# EasyEDA Pro project MAX9814音频AGC放大.eprj

# Schematic Schematic1

## Sheets
1 P1: Board Name: Board1; Create Date: 2025-06-20; Page Name: P1; Project Name: MAX9814音频AGC放大; Schematic Name: Schematic1; Update Date: 2025-06-21; Page Size: A4; Version: V1.0
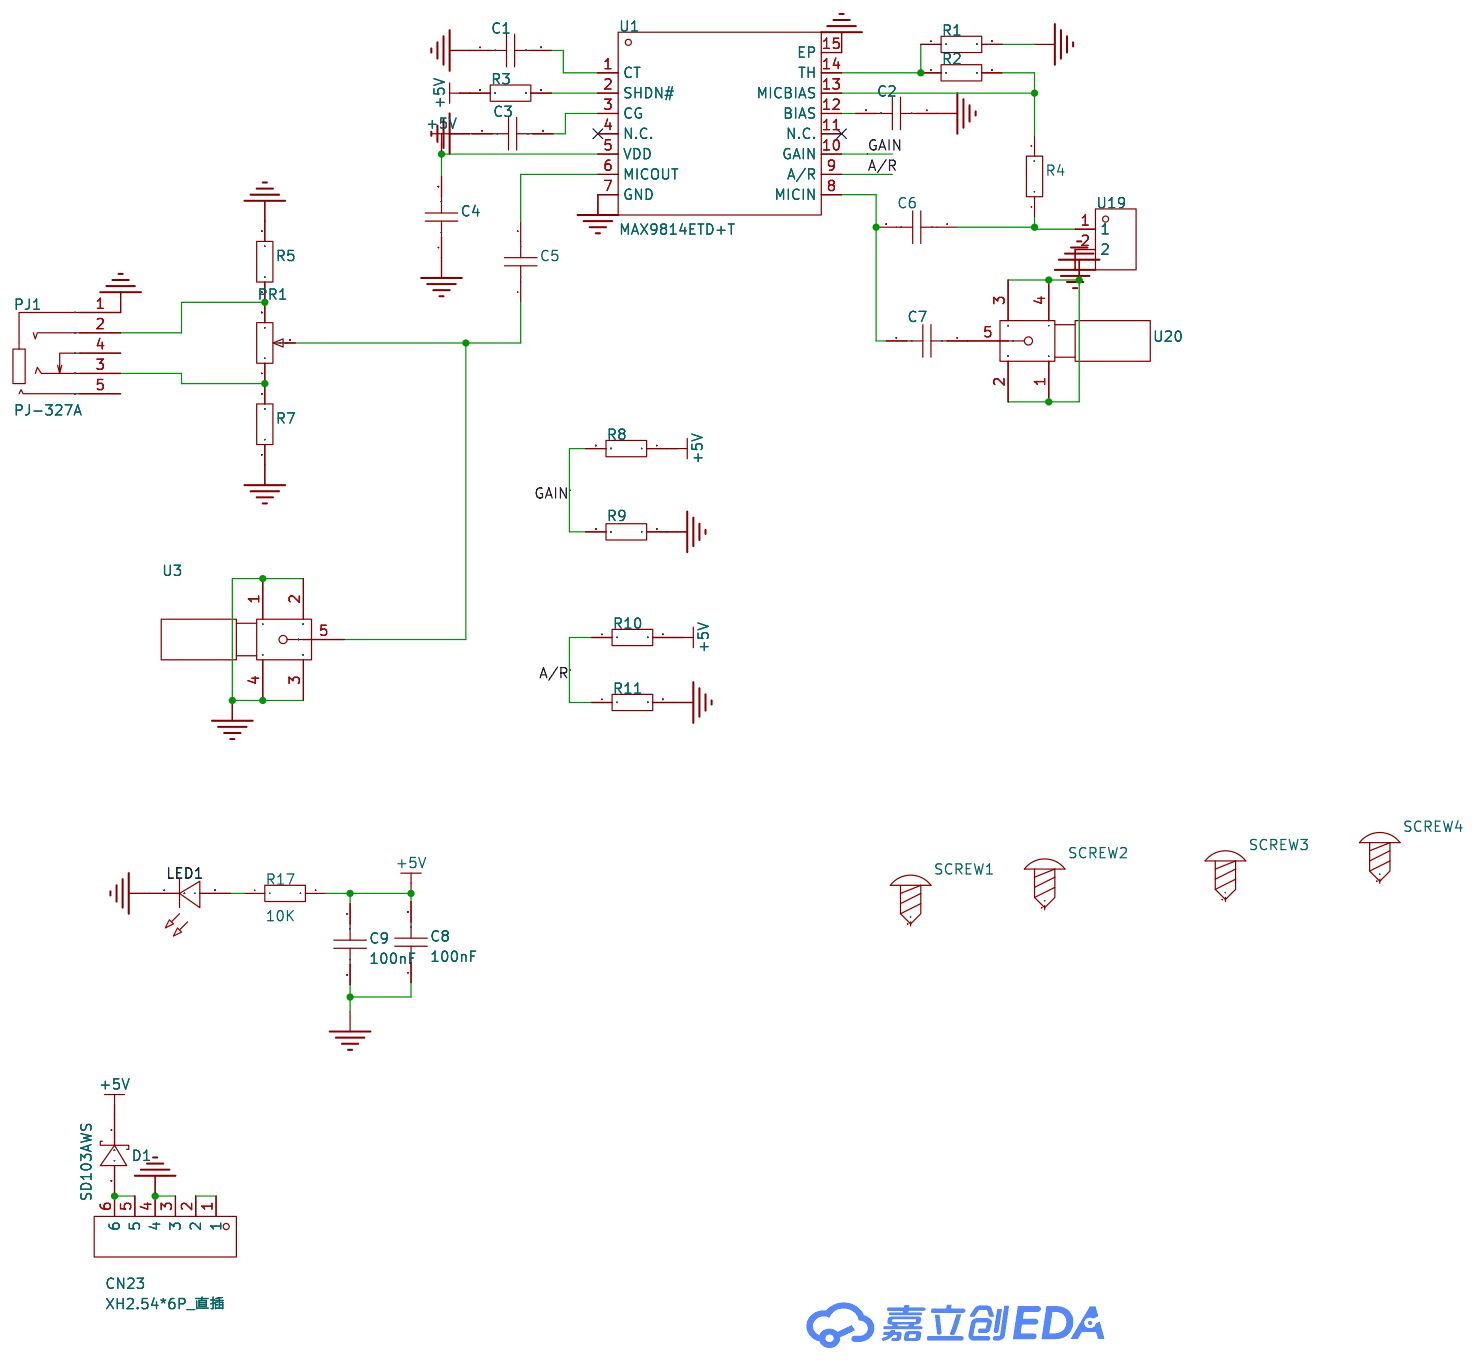
[diagram p0: P1]
2 P2: Create Date: 2025-06-24; Page Name: P2; Update Date: 2025-06-24
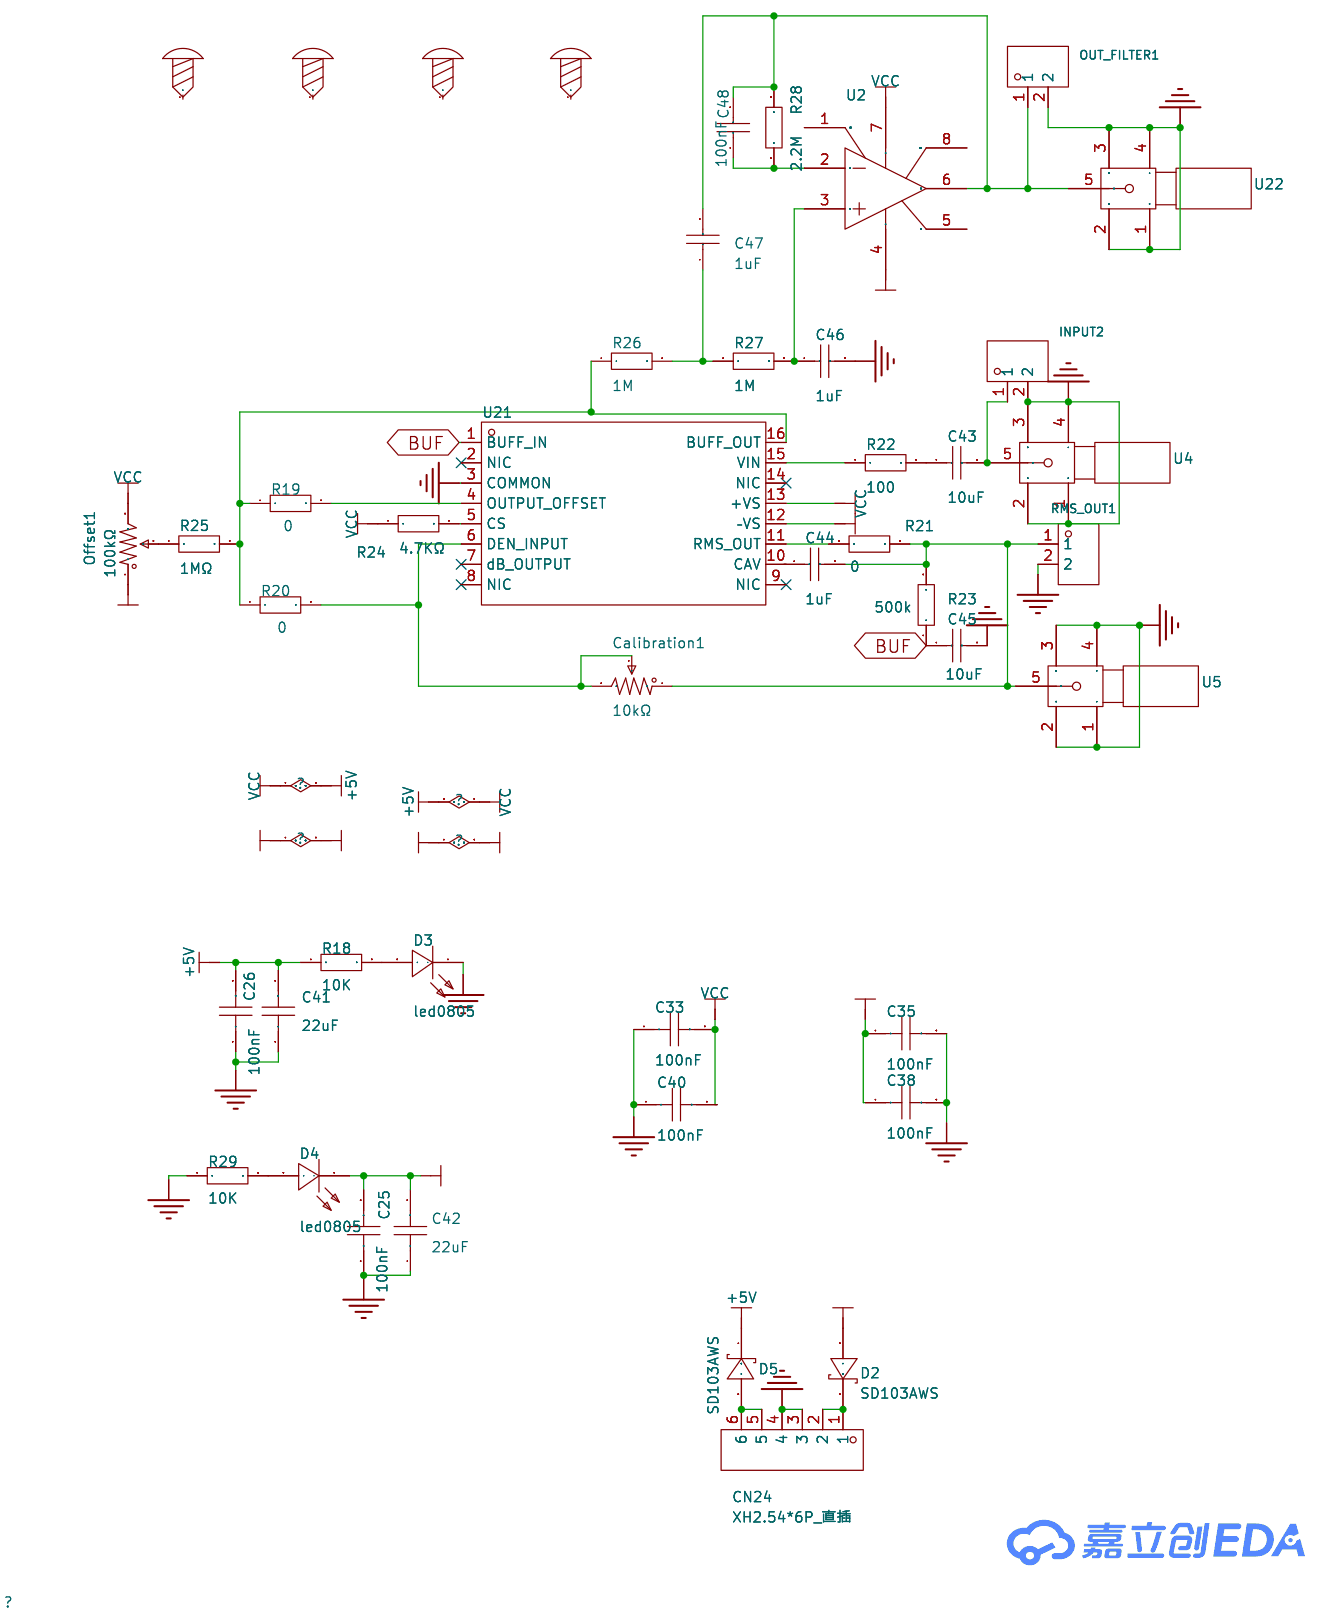
[diagram p1: P2]

## Parts
sheet P1
C1  100nF  [R0805]
C2  100nF  [R0805]
C3  100nF  [R0805]
C4  100nF  [R0805]
C5  100nF  [R0805]
C6  100nF  [R0805]
C7  100nF  [R0805]
C8  100nF  [C1206]
C9  100nF  [R0805]
CN23  XH2.54*6P_直插  [CONN-TH_XH2.54-6P]
D1  SD103AWS  [SOD-323_L1.8-W1.3-LS2.5-RD]
LED1  -  [LED_0805]
PJ1  PJ-327A  [AUDIO-IN-SMD_PJ-327A_C22355751]
PR1  10kΩ  [R_3296]
R1  10K  [R0805]
R2  10K  [R0805]
R3  10K  [R0805]
R4  10K  [R0805]
R5  10K  [R0805]
R7  10K  [R0805]
R8  10K  [R0805]
R9  10K  [R0805]
R10  10K  [R0805]
R11  10K  [R0805]
R17  10K  [R0805]
SCREW1  -  [M3螺丝]
SCREW2  -  [M3螺丝]
SCREW3  -  [M3螺丝]
SCREW4  -  [M3螺丝]
U1  MAX9814ETD+T  [TDFN-14_L3.0-W3.0-P0.40-BL-EP]
U3  -  [SMA]
U19  KF301-5.0-2P  [CONN-TH_P5.00_KF301-5.0-2P]
U20  -  [SMA]
sheet P2
C25  100nF  [R0805]
C26  100nF  [R0805]
C33  100nF  [R0805]
C35  100nF  [R0805]
C38  100nF  [R0805]
C40  100nF  [R0805]
C41  22uF  [C1210]
C42  22uF  [C1210]
C43  10uF  [R0805]
C44  1uF  [R0805]
C45  10uF  [R0805]
C46  1uF  [R0805]
C47  1uF  [R0805]
C48  100nF  [R0805]
Calibration1  10kΩ  [RES-ADJ-TH_3P-L10.0-W10.0-P2.50-L]
CN24  XH2.54*6P_直插  [CONN-TH_XH2.54-6P]
D2  SD103AWS  [SOD-323_L1.8-W1.3-LS2.5-RD]
D3  led0805  [LED0805-RD]
D4  led0805  [LED0805-RD]
D5  SD103AWS  [SOD-323_L1.8-W1.3-LS2.5-RD]
INPUT2  PZ254V-11-02P  [HDR-TH_2P-P2.54-V-M]
Offset1  100kΩ  [RES-ADJ-TH_3P-L10.0-W10.0-P2.50-L]
OUT_FILTER1  PZ254V-11-02P  [HDR-TH_2P-P2.54-V-M]
R18  10K  [R0805]
R19  0  [R0805]
R20  0  [R0805]
R21  0  [R0805]
R22  100  [R0805]
R23  500k  [R0603]
R24  4.7KΩ  [R0805]
R25  1MΩ  [R0805]
R26  1M  [R0805]
R27  1M  [R0805]
R28  2.2M  [R0805]
R29  10K  [R0805]
RMS_OUT1  PZ254V-11-02P  [HDR-TH_2P-P2.54-V-M]
SCREW5  -  [M3螺丝]
SCREW6  -  [M3螺丝]
SCREW7  -  [M3螺丝]
SCREW8  -  [M3螺丝]
U2  OP07  [SOP-8_L4.9-W3.9-P1.27-LS6.0-BL]
U4  -  [SMA]
U5  -  [SMA]
U21  AD637ARZ  [SOIC-16_L10.3-W7.5-P1.27-LS10.3-BL]
U22  -  [SMA]

## Library data of the parts
C1-C7 C9 = CAP_0603: Supplier Footprint: 0603
C8 = CAP_1206: Supplier Footprint: 1206
CN23 CN24 = XH2.54*6P_直插: Supplier Part: C9900008614; Supplier Footprint: XH2.54_6P; JLCPCB Part Class: 扩展库; Supplier: LCSC
D1 D2 D5 = SD103AWS_C181207: 正向压降(Vf):600mV@200mA;直流反向耐压(Vr):40V;整流电流:350mA;; LCSC Part Name: 电压:40V 电流:350mA 丝印S4; Supplier Part: C181207; Manufacturer: Hottech(合科泰); Supplier Footprint: SOD-323; JLCPCB Part Class: 扩展库; Datasheet: https://atta.szlcsc.com/upload/public/pdf/source/20240513/4691873FBB9173EFBCF4C6FD4BBA1025.pdf; Supplier: LCSC; Forward Voltage (Vf@If): 600mV@200mA; Reverse Voltage (Vr): 40V; Rectified Current: 350mA
LED1 = LED_0805-G: Supplier Footprint: 0805
PJ1 = PJ-327A: LCSC Part Name: 3.5mm耳机座; Supplier Part: C22355751; Manufacturer: SOFNG(硕方); Supplier Footprint: SMD; JLCPCB Part Class: 扩展库; Datasheet: https://atta.szlcsc.com/upload/public/pdf/source/20240312/2AEB1F200FF9849B98209D1ED7D816C7.pdf; Supplier: LCSC; Connector Type: 3.5mm耳机座; Current Rating: 250mA; Voltage Rating (Max): 12V; Contact Material: 磷铜; Operating Temperature: -35℃~+75℃
PR1 = R_3296: Supplier Footprint: 直插
R1-R5 R7-R11 R17-R21 R29 = Res_0805: Supplier Footprint: 0805
SCREW1-SCREW8 = M3螺丝: Supplier Footprint: 插件
U1 = MAX9814ETD+T: LCSC Part Name: 带自动增益控制和低噪声麦克风偏置的麦克风放大器; Supplier Part: C41714; Manufacturer: ADI(亚德诺)/MAXIM(美信); Supplier Footprint: TDFN-14-EP(3x3); JLCPCB Part Class: 扩展库; Datasheet: https://atta.szlcsc.com/upload/public/pdf/source/20150124/1457707262509.pdf; Supplier: LCSC; Class: AB类功放; Speaker Channels: 单声道; Voltage - Supply: 2.7V~5.5V; Operating Temperature: -40℃~+85℃
U3-U5 U20 U22 = SMA
U19 = KF301-5.0-2P: 结构:1x2P;间距:5mm;颜色:蓝色;安装方式:直插;额定电流:17A;额定电压:250V;排数:1;线规 - AWG:14~22;线规 - 平方毫米:1.5;每排PIN数:2;工作温度范围:-30℃~+120℃;; LCSC Part Name: 5mm 1x2P 排数:1 每排P数:2 直插; Supplier Part: C474881; Manufacturer: KEFA(科发); Supplier Footprint: 插件,P=5mm; JLCPCB Part Class: 扩展库; Datasheet: https://atta.szlcsc.com/upload/public/pdf/source/20230317/03A5B5FC229D6F9225E8F51DA1A4E80A.pdf; Supplier: LCSC; Structure: 1x2P; Pitch: 5mm; Color: 蓝色; Mounting Style: 直插; Current Rating (Max): 17A; Voltage Rating (Max): 250V; Number of Pins: 2P; Number of Rows: 1; Wire Gauge - AWG: 14~22; Wire Gauge - mm2: 1.5; Number of PINs Per Row: 2; Operating Temperature Range: -30℃~+120℃
C25 C26 C33 C35 C38 C40 = CAP_0805: Supplier Footprint: 0805
C41 C42 = CL32B226KAJNNNE: 容值:22uF;精度:±10%;额定电压:25V;材质(温度系数):X7R;; LCSC Part Name: 22uF ±10% 25V; Supplier Part: C309062; Manufacturer: SAMSUNG(三星); Supplier Footprint: 1210; JLCPCB Part Class: 扩展库; Datasheet: https://atta.szlcsc.com/upload/public/pdf/source/20160218/1457707763339.pdf; Supplier: LCSC; Tolerance: ±10%; Voltage Rated: 25V; Temperature Coefficient: X7R
C43-C48 = CC0805KRX7R9BB104: 容值:100nF;精度:±10%;额定电压:50V;材质(温度系数):X7R;; LCSC Part Name: 100nF ±10% 50V; Supplier Part: C49678; Manufacturer: YAGEO(国巨); Supplier Footprint: 0805; JLCPCB Part Class: Basic Part; Datasheet: https://atta.szlcsc.com/upload/public/pdf/source/20151026/1457707504898.pdf; Supplier: LCSC; Tolerance: ±10%; Voltage Rated: 50V; Temperature Coefficient: X7R
Calibration1 Offset1 = 3296W-1-103: 阻值:10kΩ;精度:±10%;; LCSC Part Name: 10kΩ ±10%; Supplier Part: C118954; Manufacturer: BOCHEN(博晨); Supplier Footprint: 插件; JLCPCB Part Class: Extended Part; Datasheet: https://atta.szlcsc.com/upload/public/pdf/source/20171114/C118954_15106326646611117443.pdf; Supplier: LCSC; Tolerance: ±10%
D3 D4 = led0805: Supplier Part: C9900012722; JLCPCB Part Class: 扩展库; Supplier: LCSC
INPUT2 OUT_FILTER1 RMS_OUT1 = PZ254V-11-02P: 排数:单排;总PIN位数:2P;间距:2.54mm;插针结构:1x2P;行距:-;安装类型:直插;圆针/方针:方针;额定电流:-;额定电压:-;配合针长度:6mm;塑高:2.5mm;端接针长度:3mm;触头材质:黄铜;触头镀层:-;工作温度范围:-40~+105;颜色:黑色;; LCSC Part Name: 2.54mm 1x2P 直插 方针; Supplier Part: C492401; Manufacturer: XFCN(兴飞); Supplier Footprint: 插件,P=2.54mm; JLCPCB Part Class: Extended Part; Datasheet: https://atta.szlcsc.com/upload/public/pdf/source/20200309/C492401_A812433581A9B211A7FFA413ADDFF0E5.pdf; Supplier: LCSC; Number of Rows: 单排; Number of Pins: 2P; Pitch: 2.54mm; Pin Structure: 1x2P; Mounting Type: 直插; Circluar Pins/Square Pins: 方针; Length of Mating Pin: 6mm; Insulation Height: 2.5mm; Length of End Connection Pin: 3mm; Contact Material: 黄铜; Operating Temperature Range: -40~+105; Color: 黑色
R22-R28 = 0805W8F1002T5E_C17414: 电阻类型:厚膜电阻;阻值:10kΩ;精度:±1%;功率:125mW;; LCSC Part Name: 10kΩ ±1% 125mW; Supplier Part: C17414; Manufacturer: UNI-ROYAL(厚声); Manufacturer Part: 0805W8F1002T5E; Supplier Footprint: 0805; JLCPCB Part Class: Basic Part; Datasheet: https://atta.szlcsc.com/upload/public/pdf/source/20200306/C422600_1E6D84923E4A46A82E41ADD87F860B5C.pdf; Supplier: LCSC; Type: 厚膜电阻; Tolerance: ±1%; Power(Watts): 125mW; Temperature Coefficient: ±100ppm/; Overload Voltage (Max): 150V; Operating Temperature Range: -55~+155
U2 = OP07: 放大器组数:-;; Supplier Part: C1508997; Manufacturer: 杭州瑞盟; Supplier Footprint: SOP-8; JLCPCB Part Class: Extended Part; Datasheet: https://atta.szlcsc.com/upload/public/pdf/source/20201221/C1508997_31DB1D3DFE7BEFB064DC1C62AA82E0AA.pdf; Supplier: LCSC
U21 = AD637ARZ: Supplier Part: C392907; Manufacturer: ADI(亚德诺)/LINEAR(凌特); Supplier Footprint: SOIC-16-300mil; JLCPCB Part Class: Extended Part; Datasheet: https://atta.szlcsc.com/upload/public/pdf/source/20190605/C392907_F1D13CB629A7AFD79CF3323A59E1C27B.pdf; Supplier: LCSC

## Nets
+5V: C4.2 C8.2 C9.1 C26.2 C33.2 C40.2 C41.2 D1.1(C) D5.1(C) Offset1.3 R3.1 R8.1 R10.2 R17.2 R18.1 R24.1 U1.5(VDD) U2.7(V+) U21.13(+VS)
-5V: C25.2 C35.1 C38.1 C42.2 D2.2(A) D4.1(-) Offset1.1 U2.4(V-) U21.12(–VS)
GND: C1.1 C2.1 C3.1 C4.1 C8.1 C9.2 C25.1 C26.1 C33.1 C35.2 C38.2 C40.1 C41.1 C42.1 C45.2 C46.2 CN23.3 CN23.4 CN24.3 CN24.4 D3.1(-) INPUT2.2 LED1.1(C) OUT_FILTER1.2 PJ1.1 R1.2 R5.2 R7.1 R9.1 R11.2 R29.1 RMS_OUT1.2 U1.7(GND) U1.15(EP) U3.1 U3.2 U3.3 U3.4 U4.1 U4.2 U4.3 U4.4 U5.1 U5.2 U5.3 U5.4 U19.2 U20.1 U20.2 U20.3 U20.4 U21.3(COMMON) U22.1 U22.2 U22.3 U22.4
A/R: R10.1 R11.1 U1.9(A/R)
BUF: C45.1 R23.1 U21.1(BUFF IN)
GAIN: R8.2 R9.2 U1.10(GAIN)
$1N911: R3.2 U1.2(SHDN#)
$1N917: C1.2 U1.1(CT)
$1N925: C3.2 U1.3(CG)
$1N1043: C5.2 U1.6(MICOUT)
$1N1073: PJ1.2 PR1.3 R5.1
$1N1075: PJ1.3 PR1.1 R7.2
$1N1127: C5.1 PR1.2 U3.5
$1N1240: R1.1 R2.1 U1.14(TH)
$1N1252: C2.2 U1.12(BIAS)
$1N1323: R2.2 R4.2 U1.13(MICBIAS)
$1N1366: C6.2 C7.2 U1.8(MICIN)
$1N1512: CN23.5 CN23.6 D1.2(A)
$1N1514: CN23.1 CN23.2
$1N1607: C6.1 R4.1 U19.1
$1N1709: C7.1 U20.5
$1N1772: LED1.2(A) R17.1
$2N1984: C43.2 INPUT2.1 U4.5
$2N1985: C43.1 R22.2
$2N1987: C44.2 Calibration1.1 R21.2 R23.2 RMS_OUT1.1 U5.5
$2N1992: R24.2 U21.5(CS)
$2N1993: Calibration1.2 Calibration1.3 R20.2 U21.6(DEN INPUT)
$2N1995: R19.1 R20.1 R25.2 R26.1 U21.16(BUFF OUT)
$2N1996: R19.2 U21.4(OUTPUT OFFSET)
$2N1997: C44.1 U21.10(CAV)
$2N1998: R21.1 U21.11(RMS OUT)
$2N1999: R22.1 U21.15(VIN)
$2N2004: Offset1.2 R25.1
$2N2005: C47.1 R26.2 R27.1
$2N2007: C46.1 R27.2 U2.3(IN+)
$2N2009: C47.2 C48.2 OUT_FILTER1.1 R28.2 U2.6(OUT) U22.5
$2N2011: C48.1 R28.1 U2.2(IN-)
$2N2019: D4.2(+) R29.2
$2N2022: D3.2(+) R18.2
$2N2028: CN24.5 CN24.6 D5.2(A)
$2N2030: CN24.1 CN24.2 D2.1(C)

Not connected (* = marked no-connect by the designer): PJ1 4 5; SCREW1 1; SCREW2 1; SCREW3 1; SCREW4 1; SCREW5 1; SCREW6 1; SCREW7 1; SCREW8 1; U1 4(N.C.)* 11(N.C.)*; U2 1(VOS TRIM) 5(NC) 8(VOS TRIM); U21 2(NIC)* 7(dB OUTPUT)* 8(NIC)* 9(NIC)* 14(NIC)*

# Board PCB1
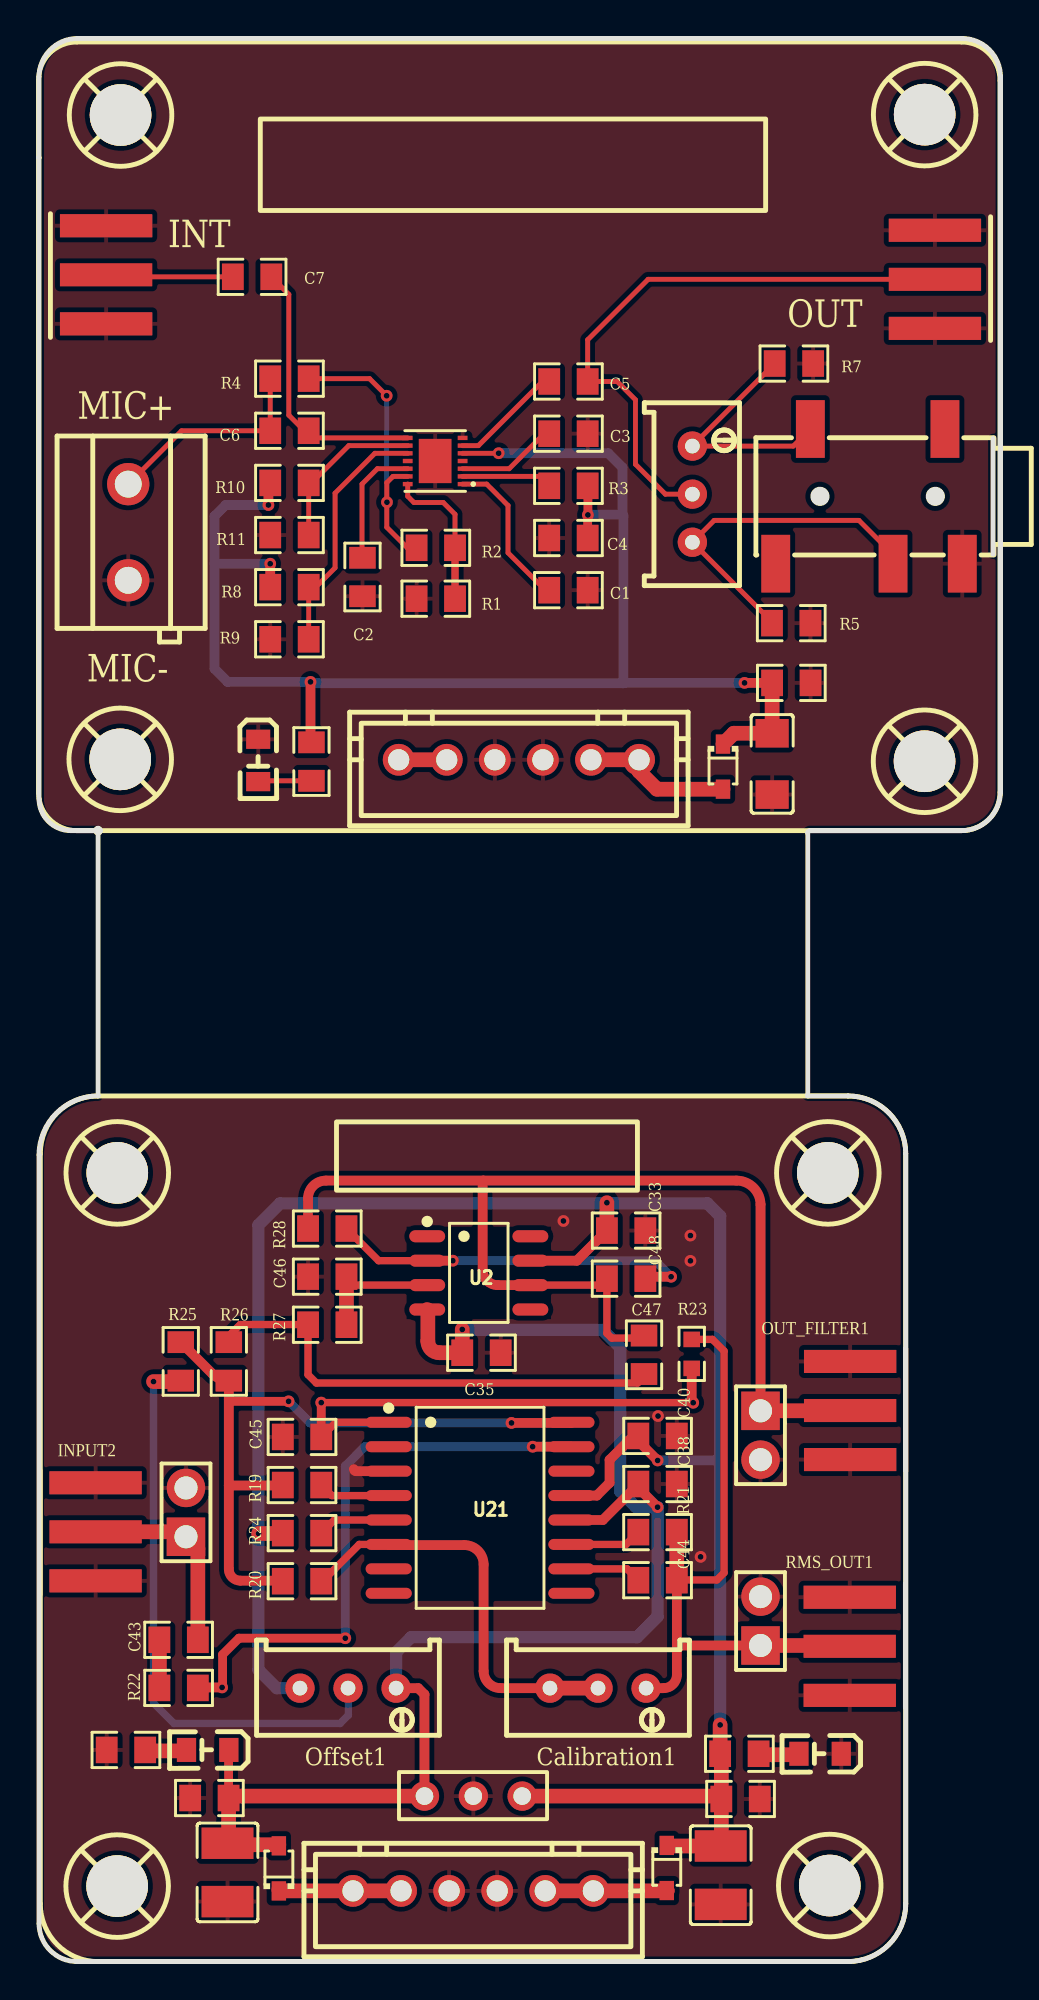
[diagram p2: board, top side]
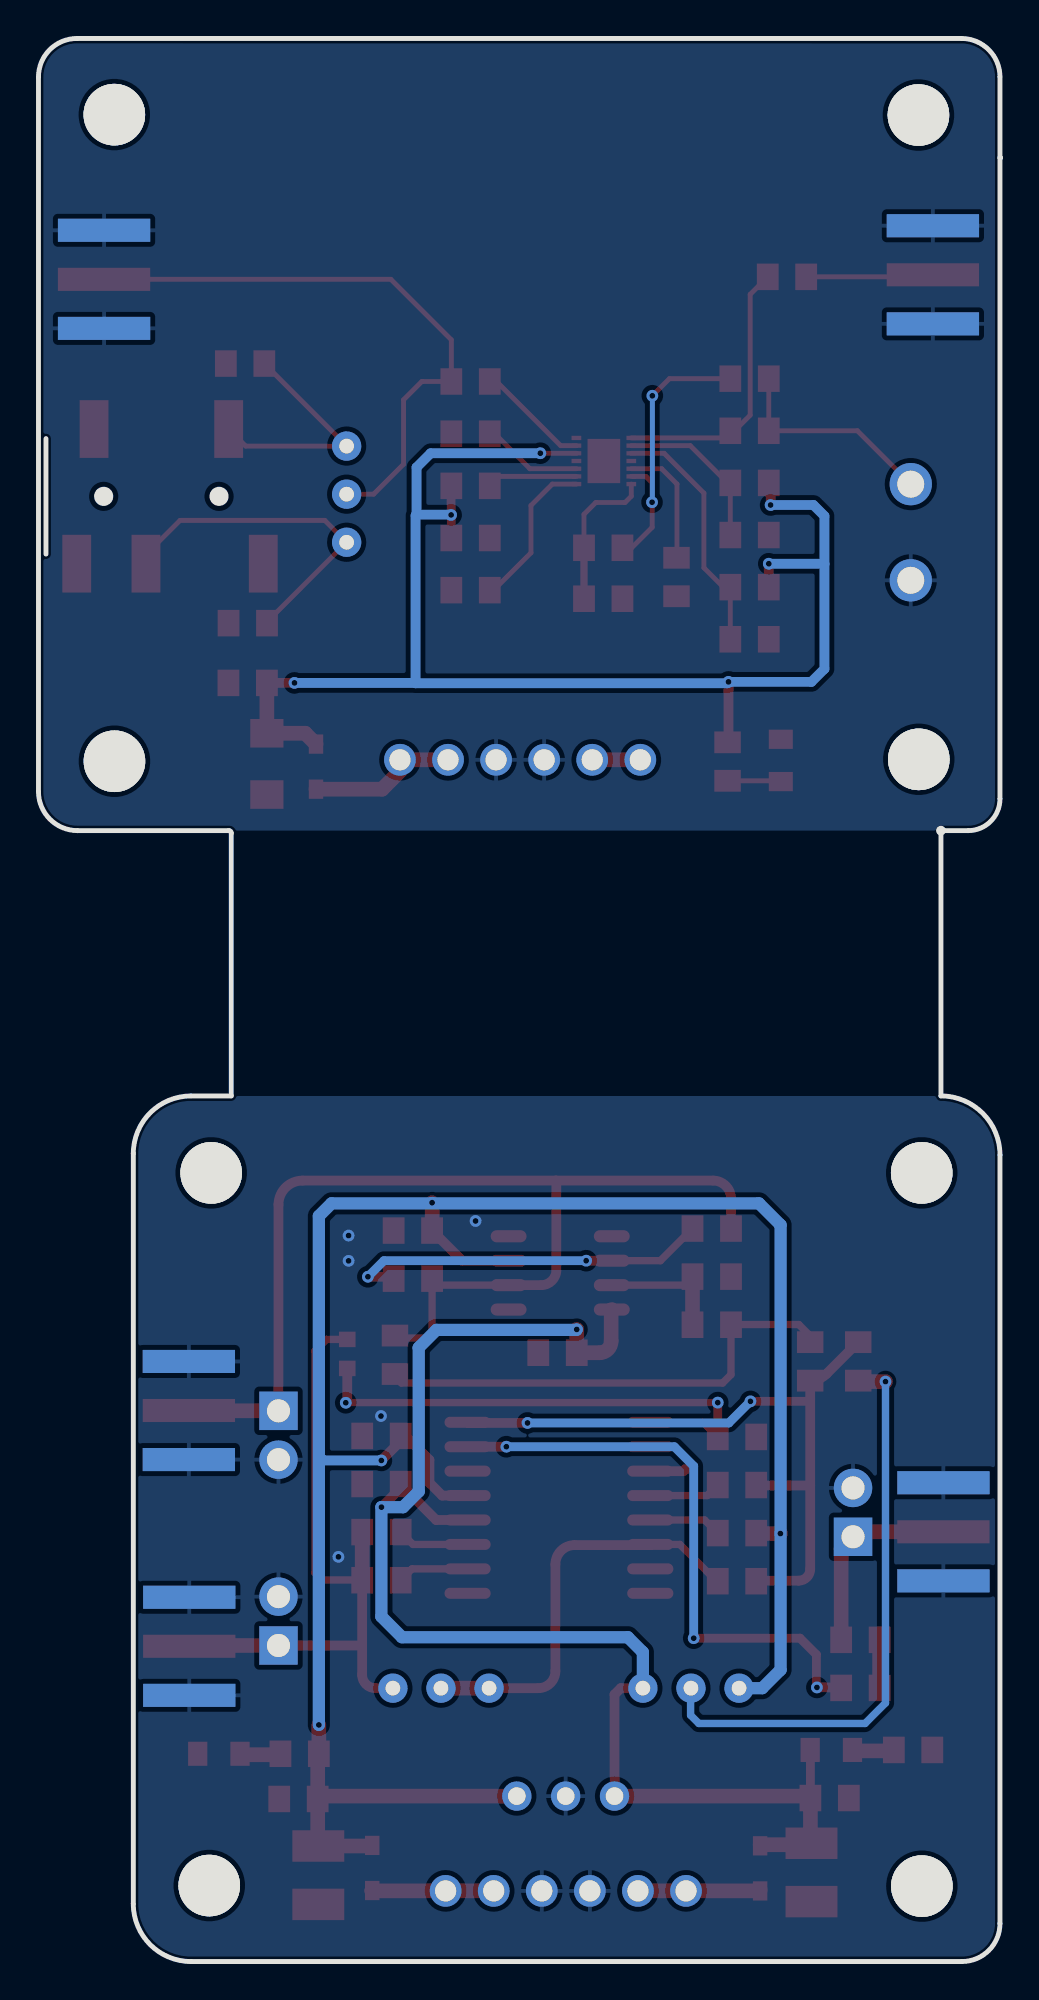
[diagram p3: board, bottom side, seen from below]

Outline 50.03 x 99.98 mm; copper layers: Top Layer, Bottom Layer. Coordinates in mm from the lower left corner of the outline.
Outline path: 0,93.78 arc(0.02,93.77) 0.03,93.75 0.03,60.44 arc(0.51,59.28) 1.68,58.79 3.1,58.79 3.1,45 arc(0.93,44.1) 0.03,41.93 0.03,1.98 arc(0.61,0.58) 2.01,0 42.1,0 arc(44.22,0.88) 45.1,3 45.1,42 arc(44.22,44.12) 42.1,45 40.01,45 40.01,58.68 arc(40.04,58.76) 40.12,58.79 48,58.79 arc(49.44,59.39) 50.03,60.82 50.03,97.98 arc(49.44,99.39) 48.03,99.98 2.03,99.98 arc(0.62,99.39) 0.03,97.98 0.03,93.81 arc(0.02,93.79) 0,93.78
Stack: Top Layer 0.035mm / Dielectric1 1.51mm FR4 er 4.5 / Bottom Layer 0.035mm

## Design rules (mm)
template: JLCPCB Capability(Two Layers Board)
spacing copperThickness1oz (default): track to track 0.102, other pairs 0.152 to 0.3
spacing copperThickness2oz: track to track 0.203, other pairs 0.152 to 0.3
track width copperThickness1oz (default): min 0.127, default 0.254, max 2.54
track width copperThickness2oz: min 0.203, default 0.254, max 2.54
differential pair differentialPair (default): width min 0.127, default 0.254, max 2.54; gap min 0.152, default 0.152
via viaSize (default): diameter min 0.5, default 0.61, max 10; hole min 0.3, default 0.305, max 6.3

## Placement (name value [footprint] x y rotation side)
C1  100nF  [R0805]  27.45 71.29 180 top
C2  100nF  [R0805]  16.85 72.09 90 top
C3  100nF  [R0805]  27.45 79.43 180 top
C4  100nF  [R0805]  27.67 74.01 0 top
C5  100nF  [R0805]  27.45 82.14 180 top
C6  100nF  [R0805]  13.16 79.58 0 top
C7  100nF  [R0805]  11.22 87.58 0 top
C8  100nF  [C1206]  38.15 62.26 90 top
C9  100nF  [R0805]  39.26 66.47 0 top
C25  100nF  [R0805]  9 8.5 0 top
C26  100nF  [R0805]  36.4 8.45 180 top
C33  100nF  [R0805]  30.45 38 180 top
C35  100nF  [R0805]  23.15 31.65 0 top
C38  100nF  [R0805]  32.31 24.83 0 top
C40  100nF  [R0805]  32.08 27.33 180 top
C41  22uF  [C1210]  35.48 4.49 90 top
C42  22uF  [C1210]  9.83 4.63 90 top
C43  10uF  [R0805]  7.4 16.73 0 top
C44  1uF  [R0805]  32.31 19.83 0 top
C45  10uF  [R0805]  13.6 27.27 180 top
C46  1uF  [R0805]  14.91 35.61 180 top
C47  1uF  [R0805]  31.49 31.65 90 top
C48  100nF  [R0805]  30.45 35.5 180 top
Calibration1  10kΩ  [RES-ADJ-TH_3P-L10.0-W10.0-P2.50-L]  29.1 14.21 180 top
CN23  XH2.54*6P_直插  [CONN-TH_XH2.54-6P]  24.98 62.48 0 top
CN24  XH2.54*6P_直插  [CONN-TH_XH2.54-6P]  22.61 3.67 0 top
D1  SD103AWS  [SOD-323_L1.8-W1.3-LS2.5-RD]  35.6 62.12 270 top
D2  SD103AWS  [SOD-323_L1.8-W1.3-LS2.5-RD]  12.5 4.84 90 top
D3  led0805  [LED0805-RD]  40.65 10.8 180 top
D4  led0805  [LED0805-RD]  8.8 11 180 top
D5  SD103AWS  [SOD-323_L1.8-W1.3-LS2.5-RD]  32.67 4.86 270 top
INPUT2  PZ254V-11-02P  [HDR-TH_2P-P2.54-V-M]  7.67 23.35 90 top
LED1  -  [LED_0805]  11.42 62.39 270 top
NOREF  -  [Pad_e419]  20.07 8.6 0 top
NOREF#2  -  [Pad_e420]  22.61 8.6 0 top
NOREF#3  -  [Pad_e421]  25.15 8.6 0 top
Offset1  100kΩ  [RES-ADJ-TH_3P-L10.0-W10.0-P2.50-L]  16.1 14.21 180 top
OUT_FILTER1  PZ254V-11-02P  [HDR-TH_2P-P2.54-V-M]  37.55 27.36 270 top
PJ1  PJ-327A  [AUDIO-IN-SMD_PJ-327A_C22355751]  43.19 76.17 180 top
PR1  10kΩ  [R_3296]  34.13 76.29 270 top
R1  10K  [R0805#2]  20.66 70.85 180 top
R2  10K  [R0805#2]  20.66 73.5 180 top
R3  10K  [R0805#2]  27.56 76.72 180 top
R4  10K  [R0805#2]  13.05 82.29 0 top
R5  10K  [R0805#2]  39.15 69.58 0 top
R7  10K  [R0805#2]  39.29 83.08 180 top
R8  10K  [R0805#2]  13.05 71.45 0 top
R9  10K  [R0805#2]  13.05 68.74 0 top
R10  10K  [R0805#2]  13.05 76.87 180 top
R11  10K  [R0805#2]  13.05 74.16 180 top
R17  10K  [R0805#2]  14.2 62.38 90 top
R18  10K  [R0805#2]  36.45 10.8 0 top
R19  0  [R0805#2]  13.71 24.77 0 top
R20  0  [R0805#2]  13.71 19.77 0 top
R21  0  [R0805#2]  32.2 22.33 0 top
R22  100  [R0805#2]  7.29 14.23 180 top
R23  500k  [R0603]  33.83 31.57 90 top
R24  4.7KΩ  [R0805#2]  13.71 22.27 0 top
R25  1MΩ  [R0805#2]  7.4 31.2 90 top
R26  1M  [R0805#2]  9.9 31.2 90 top
R27  1M  [R0805#2]  15.02 33.11 0 top
R28  2.2M  [R0805#2]  15.02 38.11 180 top
R29  10K  [R0805#2]  4.55 11 0 top
RMS_OUT1  PZ254V-11-02P  [HDR-TH_2P-P2.54-V-M]  37.55 17.7 90 top
SCREW1  -  [M3螺丝]  46.09 96.02 180 top
SCREW2  -  [M3螺丝]  4.27 96 180 top
SCREW3  -  [M3螺丝]  46.08 62.4 180 top
SCREW4  -  [M3螺丝]  4.25 62.5 180 top
SCREW5  -  [M3螺丝]  4.1 41 0 top
SCREW6  -  [M3螺丝]  41.05 41 0 top
SCREW7  -  [M3螺丝]  4.09 3.92 0 top
SCREW8  -  [M3螺丝]  41.15 3.95 0 top
U1  MAX9814ETD+T  [TDFN-14_L3.0-W3.0-P0.40-BL-EP]  20.63 78.01 90 top
U2  OP07  [SOP-8_L4.9-W3.9-P1.27-LS6.0-BL]  22.9 35.8 270 top
U3  -  [SMA]  50.43 93.32 180 top
U4  -  [SMA]  -0.84 16.48 0 top
U5  -  [SMA]  46 22.25 180 top
U19  KF301-5.0-2P  [CONN-TH_P5.00_KF301-5.0-2P]  4.67 74.31 270 top
U20  -  [SMA]  -0.29 81.83 0 top
U21  AD637ARZ  [SOIC-16_L10.3-W7.5-P1.27-LS10.3-BL]  22.96 23.59 270 top
U22  -  [SMA]  46.02 34.51 180 top

## Footprints (pads in the part's own frame, mm; a bottom-side part is the same pattern mirrored in y, then rotated)
AUDIO-IN-SMD_PJ-327A_C22355751
  rect 1.5x3 smd: 1(-4.85,3.5) 2(-1.25,3.5) 3(3.05,-3.5) 4(4.85,3.5) 5(-3.95,-3.5)
C1206
  rect 1.485x1.728 smd: 1(-1.593,0) 2(1.593,0)
C1210
  rect 1.635x2.7 smd: 1(-1.518,0) 2(1.518,0)
CONN-TH_P5.00_KF301-5.0-2P
  round 2.2 hole 1.4: 1(-2.5,0) 2(2.5,0)
CONN-TH_XH2.54-6P
  round 1.65 hole 1.1: 1(-6.25,0) 2(-3.75,0) 3(-1.25,0) 4(1.25,0) 5(3.75,0) 6(6.25,0)
HDR-TH_2P-P2.54-V-M
  rect 2x2 hole 1.2: 1(-1.27,0)
  round 2 hole 1.2: 2(1.27,0)
LED0805-RD
  rect 1x1.25 smd: 1(-1.1,0) 2(1.1,0)
LED_0805
  rect 1x1.25 smd: 1(-1.15,0.005) 2(1.05,0.005)
M3螺丝
  round 3.2 hole 3.2: 1(0,0)
Pad_e419
  round 1.524 hole 0.914: 1(0,0)
Pad_e420
  round 1.524 hole 0.914: 2(0,0)
Pad_e421
  round 1.524 hole 0.914: 3(0,0)
R0603
  rect 0.806x0.864 smd: 1(-0.739,-0.146) 2(0.768,-0.146)
R0805
  rect 1.133x1.377 smd: 1(-1.111,0) 2(0.889,0)
R0805#2
  rect 1.133x1.377 smd: 1(-1,0) 2(1,0)
R_3296
  round 1.524 hole 0.762: 1(-2.499,-0.127) 2(0,-0.127) 3(2.499,-0.127)
RES-ADJ-TH_3P-L10.0-W10.0-P2.50-L
  round 1.524 hole 0.762: 1(-2.5,0) 2(0,0) 3(2.5,0)
SMA
  rect 4.8x1.2 smd: 1(3.81,8.412) 2(3.81,3.312) 5(3.81,5.862)
  rect 4.8x1.2 smd far side: 3(3.81,3.312) 4(3.81,8.412)
SOD-323_L1.8-W1.3-LS2.5-RD
  rect 1x0.75 smd: 1(-1.173,0) 2(1.173,0)
SOIC-16_L10.3-W7.5-P1.27-LS10.3-BL
  oval 0.574x2.401 smd: 1(-4.445,-4.75) 2(-3.175,-4.75) 3(-1.905,-4.75) 4(-0.635,-4.75) 5(0.635,-4.75) 6(1.905,-4.75) 7(3.175,-4.75) 8(4.445,-4.75) 9(4.445,4.75) 10(3.175,4.75) 11(1.905,4.75) 12(0.635,4.75) 13(-0.635,4.75) 14(-1.905,4.75) 15(-3.175,4.75) 16(-4.445,4.75)
SOP-8_L4.9-W3.9-P1.27-LS6.0-BL
  oval 0.63x1.865 smd: 1(-1.905,-2.683) 2(-0.635,-2.683) 3(0.635,-2.683) 4(1.905,-2.683) 5(1.905,2.683) 6(0.635,2.683) 7(-0.635,2.683) 8(-1.905,2.683)
TDFN-14_L3.0-W3.0-P0.40-BL-EP
  rect 0.224x0.505 smd: 1(-1.2,-1.427) 2(-0.8,-1.427) 3(-0.4,-1.427) 4(0,-1.427) 5(0.4,-1.427) 6(0.8,-1.427) 7(1.2,-1.427) 8(1.2,1.427) 9(0.8,1.427) 10(0.4,1.427) 11(0,1.427) 12(-0.4,1.427) 13(-0.8,1.427) 14(-1.2,1.427)
  rect 2.3x1.7 smd: 15(0,0)

## Nets
As in the schematic, except:
+5V: C4.2 C8.2 C9.1 C26.2 C33.2 C40.2 C41.2 D1.1 D5.1 NOREF#3.3 Offset1.3 R3.1 R8.1 R10.2 R17.2 R18.1 R24.1 U1.5 U2.7 U21.13
-5V: C25.2 C35.1 C38.1 C42.2 D2.2 D4.1 NOREF.1 Offset1.1 U2.4 U21.12
GND: C1.1 C2.1 C3.1 C4.1 C8.1 C9.2 C25.1 C26.1 C33.1 C35.2 C38.2 C40.1 C41.1 C42.1 C45.2 C46.2 CN23.3 CN23.4 CN24.3 CN24.4 D3.1 INPUT2.2 LED1.1 NOREF#2.2 OUT_FILTER1.2 PJ1.1 R1.2 R5.2 R7.1 R9.1 R11.2 R29.1 RMS_OUT1.2 U1.7 U1.15 U3.1 U3.2 U3.3 U3.4 U4.1 U4.2 U4.3 U4.4 U5.1 U5.2 U5.3 U5.4 U19.2 U20.1 U20.2 U20.3 U20.4 U21.3 U22.1 U22.2 U22.3 U22.4

Pads without a net: PJ1 4 5; SCREW1 1; SCREW2 1; SCREW3 1; SCREW4 1; SCREW5 1; SCREW6 1; SCREW7 1; SCREW8 1; U1 4 11; U2 1 5 8; U21 2 7 8 9 14

## Via types
v1: diameter 0.61, hole 0.305, Top Layer to Bottom Layer, 29 vias

## Routing (per net, layer and track width the routed paths; a pad name or vN(x,y) marks a point on that pad's centre or on a via; arc(x,y) is an arc through that point)
+5V: length 192.5
  Top Layer w0.254: v1(23.93,78.41) 23.93,78.41 U1.5
  Top Layer w0.457: R3.1 28.57,76.71 v1(28.57,75.21) 28.56,75.19 C4.2
  Top Layer w0.508: R10.2 11.96,76.78 v1(11.96,75.72) ; v1(36.72,66.47) C9.1 ; v1(32.2,26.05) 31.2,27.05 C40.2 30.95,27.33 29.7,26.08 29.7,24.89 29.04,24.22 U21.13 ; v1(14.15,66.53) 14.15,63.43 R17.2 ; 29.56,38 28,36.44 U2.7 ; R8.1 12.05,72.67
  Top Layer w0.762: D1.1 36.16,63.86 C8.2 ; v1(11.45,22.25) 12.68,22.25 arc(12.7,22.26) R24.1 ; C26.2 35.51,6.04 arc(35.5,6.01) C41.2 32.72,6.01 arc(32.7,6.01) 32.7,6.02 ; C26.2 35.51,10.69 arc(35.49,10.73) 35.45,10.75 ; C26.2 arc(35.47,8.56) 35.36,8.6 NOREF#3.3 ; 29.56,38 v1(29.56,39.45) ; v1(35.45,12.3) R18.1 ; 38.15,63.86 C9.1
  Bottom Layer w0.508: v1(23.93,78.41) 29.63,78.41 30.37,77.68 30.37,75.22 ; 35.23,26.1 35.18,26.05 v1(32.2,26.05) ; 30.37,75.22 30.42,75.17 30.42,66.46 ; 30.37,75.22 28.58,75.22 v1(28.57,75.21) ; 30.42,66.46 30.44,66.47 v1(36.72,66.47) ; 30.42,66.46 14.22,66.46 v1(14.15,66.53) 9.83,66.53 9.16,67.2 9.16,72.67 ; v1(12.05,72.67) 9.16,72.67 ; 9.16,72.67 9.16,75.15 9.73,75.72 v1(11.96,75.72)
  Bottom Layer w0.635: v1(35.45,12.3) 35.45,38.76 34.79,39.42 12.56,39.42 11.44,38.29 11.44,15.17 12.39,14.21 Offset1.3
-5V: length 75.9
  Top Layer w0.457: C25.2 9.89,10.99 D4.1
  Top Layer w0.508: Offset1.1 19.75,14.21 20.07,13.88 NOREF.1 ; U21.12 29.35,22.95 31.2,24.8 ; 31.2,24.8 31.2,24.62 v1(32.2,23.62) ; 31.2,24.8 C38.1
  Top Layer w0.762: v1(22.04,32.86) 22.04,31.65 20.85,31.65 arc(20.43,31.83) 20.25,32.25 20.25,33.86 arc(20.24,33.89) U2.4 ; NOREF.1 9.99,8.6 arc(9.94,8.59) 9.9,8.55 arc(9.89,8.52) C25.2 9.89,6.21 arc(9.87,6.17) C42.2 arc(9.85,6.1) 9.91,6.07 12.5,6.07
  Bottom Layer w0.635: Offset1.1 18.6,16.08 19.38,16.86 31.13,16.86 32.2,17.93 32.2,23.62 ; v1(22.04,32.86) 22.06,32.84 29.33,32.84 30.26,31.91 30.26,24.44 31.07,23.62 v1(32.2,23.62)
GND: length 1.9
  Top Layer w0.508: U21.3 16.51,25.49 arc(16.43,25.53) 16.4,25.6
  vias: v1(27.3,38.5) v1(32.22,28.36) v1(33.9,37.74) v1(33.9,36.43) v1(34.43,21.04)
A/R: length 8.7
  Top Layer w0.254: R11.1 R10.1 14.2,76.87 16.14,78.81 U1.9
BUF: length 26.8
  Top Layer w0.381: U21.1 15.47,28.03 C45.1 ; v1(14.71,29.06) 34.04,29.06
  Top Layer w0.457: C45.1 v1(14.71,29.06)
  Top Layer w0.508: 33.97,30.53 33.97,29.13 34.04,29.06 v1(34.05,29.05) ; 33.97,30.53 R23.1 ; 33.97,30.53 arc(33.97,30.54) 33.96,30.54
GAIN: length 13.2
  Top Layer w0.254: 14.42,71.45 R8.2 ; 14.42,71.45 15.43,72.46 15.43,76.34 17.5,78.41 U1.10 ; 14.42,71.45 14.05,71.09 R9.2
$1N911: length 4.7
  Top Layer w0.254: U1.2 26.07,77.21 R3.2
$1N917: length 8.2
  Top Layer w0.254: U1.1 23.31,76.81 24.42,75.7 24.42,73.24 26.36,71.29 26.56,71.29
$1N925: length 5.3
  Top Layer w0.254: U1.3 24.48,77.61 26.3,79.43 26.56,79.43
$1N1043: length 5.9
  Top Layer w0.254: U1.6 22.88,78.81 26.21,82.14 26.56,82.14
$1N1073: length 18
  Top Layer w0.254: PJ1.2 44.44,73.15 42.67,74.92 35.14,74.92 PR1.3 38.15,69.65 R5.1
$1N1075: length 12.6
  Top Layer w0.254: R7.2 34.01,78.79 PR1.1 39.25,78.79 40.14,79.67
$1N1127: length 31.4
  Top Layer w0.254: U3.5 31.7,87.45 28.56,84.31 28.56,82.14 30.09,82.14 31.05,81.19 31.05,77.84 32.6,76.29 PR1.2
$1N1240: length 7.9
  Top Layer w0.254: U1.14 19.2,76.18 19.53,75.85 21.05,75.85 21.66,75.24 R2.1
  Top Layer w0.381: R2.1 R1.1
$1N1252: length 6.5
  Top Layer w0.254: C2.2 16.83,73 16.83,76.81 17.62,77.61 U1.12
$1N1323: length 15.5
  Top Layer w0.254: R2.2 19.18,73.5 18.11,74.56 18.11,76.89 18.44,77.21 U1.13 ; R4.2 17.22,82.29 v1(18.11,81.4)
  Bottom Layer w0.254: v1(18.11,81.4) 18.11,75.88 v1(18.12,75.87)
$1N1366: length 14.2
  Top Layer w0.254: U1.8 14.2,79.21 13.02,80.39 13.02,86.67 C7.2
$1N1512: length 7.8
  Top Layer w0.762: D1.2 32.16,60.95 31.23,61.87 CN23.6 CN23.5
$1N1514: length 2.5
  Top Layer w0.762: CN23.1 CN23.2
$1N1607: length 11
  Top Layer w0.254: 11.83,79.58 7.44,79.58 U19.1 ; R4.1 C6.1
$1N1709: length 6.6
  Top Layer w0.254: 3.52,87.69 3.62,87.58 C7.1
$1N1772: length 2.8
  Top Layer w0.254: 11.43,61.34 11.47,61.38 R17.1
$2N1984: length 10.6
  Top Layer w0.762: 8.29,16.73 8.29,21.47 arc(8.11,21.9) INPUT2.1 arc(7.6,22.26) 7.41,22.34 U4.5
$2N1985: length 2.5
  Top Layer w0.762: C43.1 6.29,14.23
$2N1987: length 34.5
  Top Layer w0.381: R23.2 35.05,32.34 35.65,31.74 35.65,20.21 35.28,19.84 33.21,19.84 C44.2
  Top Layer w0.508: RMS_OUT1.1 33.25,16.43 arc(33.21,16.44) 33.2,16.48 ; 33.2,16.48 33.2,19.82 arc(33.2,19.82) C44.2 ; 33.2,16.48 33.2,14.9 arc(33,14.41) 32.51,14.21 Calibration1.1
  Top Layer w0.762: C44.2 R21.2 ; RMS_OUT1.1 42.15,16.43 arc(42.18,16.42) U5.5
$2N1992: length 3.8
  Top Layer w0.381: U21.5 15.39,22.95 R24.2
$2N1993: length 21.8
  Top Layer w0.381: R20.2 14.77,19.77 16.68,21.68 U21.6
  Top Layer w0.508: Calibration1.3 24.04,14.21 arc(23.41,14.47) 23.15,15.1 23.15,20.65 arc(22.86,21.36) 22.15,21.65 18.25,21.65 arc(18.22,21.66) U21.6
  Top Layer w0.762: Calibration1.3 Calibration1.2
$2N1995: length 37.4
  Top Layer w0.457: 9.9,29.24 10.02,29.12 v1(13.01,29.12)
  Top Layer w0.508: 9.9,24.75 9.9,20.4 arc(10.08,19.98) 10.5,19.8 12.68,19.8 arc(12.7,19.79) R20.1 ; 9.9,24.75 12.68,24.75 arc(12.7,24.75) R19.1 ; 9.9,24.75 R26.1 arc(9.44,30.29) 9.05,30.55 R25.2 ; v1(24.6,28) 27.68,28 arc(27.71,28.01) U21.16
  Bottom Layer w0.457: v1(24.6,28) 14.13,28 v1(13.01,29.12)
$2N1996: length 3.7
  Top Layer w0.381: U21.4 15.25,24.22 R19.2
$2N1997: length 3.7
  Top Layer w0.381: C44.1 30.61,20.41 U21.10
$2N1998: length 3.7
  Top Layer w0.381: U21.11 30.55,21.68 R21.1
$2N1999: length 30.9
  Top Layer w0.457: v1(9.55,14.25) 9.58,14.28 9.58,15.96 10.43,16.81 v1(15.96,16.81)
  Top Layer w0.508: v1(9.55,14.25) 8.31,14.25 arc(8.3,14.24) R22.1 ; U21.15 v1(25.7,26.76)
  Bottom Layer w0.457: v1(25.7,26.76) 16.96,26.76 15.96,25.76 v1(15.96,16.81)
$2N2004: length 30.3
  Top Layer w0.762: v1(5.98,30.15) 7.35,30.15 arc(7.38,30.16) R25.1
  Bottom Layer w0.381: Offset1.2 16.12,14.19 16.12,12.81 15.69,12.38 7.05,12.38 5.98,13.44 v1(5.98,30.15)
$2N2005: length 25.1
  Top Layer w0.381: 14,33.09 13.97,33.12 10.49,33.12 9.9,32.52 R26.2 ; R27.1 14.02,30.51 14.45,30.08 31.15,30.08 31.49,30.41
  Top Layer w0.508: 14,33.09 arc(14,33.09) 14.01,33.1 arc(14.01,33.1) R27.1
$2N2007: length 6.9
  Top Layer w0.381: C46.1 16.46,35.17 U2.3
  Top Layer w0.762: R27.2 C46.1
$2N2009: length 58.3
  Top Layer w0.381: 31.49,32.41 29.81,32.41 29.56,32.66 29.56,35.5 29.23,35.17 U2.6
  Top Layer w0.508: R28.2 14.02,39.67 arc(14.29,40.33) 14.95,40.6 23.13,40.6 ; U2.6 23.88,35.17 arc(23.33,35.39) 23.1,35.95 23.1,40.57 arc(23.11,40.59) 23.13,40.6 ; 23.13,40.6 36.3,40.6 arc(37.18,40.23) 37.55,39.35 OUT_FILTER1.1
  Top Layer w0.762: OUT_FILTER1.1 42.19,28.63 arc(42.2,28.63) U22.5
$2N2011: length 19.3
  Top Layer w0.381: R28.1 17.69,36.44 U2.2
  Top Layer w0.508: U2.2 v1(21.55,36.44) ; v1(32.9,35.6) 31.66,35.6 arc(31.59,35.57) 31.56,35.5
  Bottom Layer w0.457: v1(32.9,35.6) 32.06,36.44 v1(21.55,36.44)
$2N2019: length 2.1
  Top Layer w0.762: 7.7,10.95 5.55,10.95
$2N2022: length 2.1
  Top Layer w0.762: 37.45,10.75 39.55,10.75
$2N2028: length 6.3
  Top Layer w0.762: CN24.5 CN24.6 32.69,3.67 arc(32.7,3.67) 32.7,3.68
$2N2030: length 6.4
  Top Layer w0.762: CN24.2 CN24.1 12.55,3.67 arc(12.52,3.69) 12.5,3.73

## Copper pours and planes (outline as drawn; the poured copper is in the pictures)
GND on Top Layer: -3.06,108.53 56.65,108.53 56.65,-11.35 -3.06,-11.35
GND on Bottom Layer: -7.1,113.02 57.55,113.02 57.55,-18.09 -7.1,-18.09

## Text on the board
Top Solder Mask Layer: AD637峰值检测 | MAX9814音频AGC
Top Silkscreen Layer: MIC+ | MIC- | INT | OUT
